# EAGLE design MAX4070_roznicowy_analog (EAGLE 6.3)
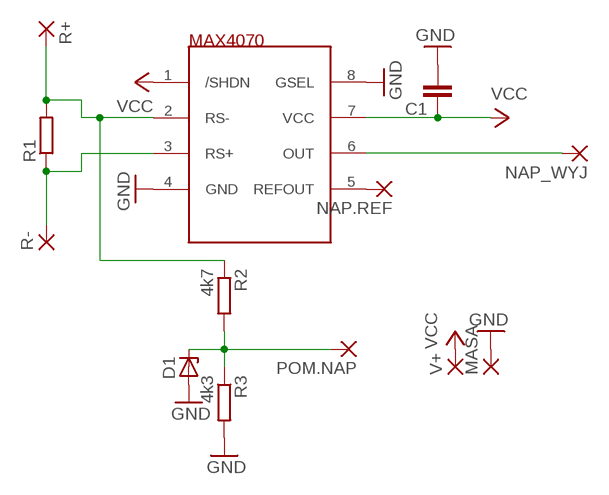
[diagram p0: schematic, sheet 1]

## Parts
C1  C-EUC1206  [C1206]
D1  ZENER-DIODESOD80C  [SOD80C]
MASA  1,6/0,8  [1,6/0,8]
NAP.REF  1,6/0,8  [1,6/0,8]
NAP_WYJ  1,6/0,8  [1,6/0,8]
POM.NAP  1,6/0,8  [1,6/0,8]
R1  R-EU_0617/22  [0617/22]
R2  4k7  R-EU_0207/10  [0207/10]
R3  4k3  R-EU_0207/10  [0207/10]
R+  1,6/0,8  [1,6/0,8]
R-  1,6/0,8  [1,6/0,8]
U$1  MAX4070  [UMAX8]
V+  1,6/0,8  [1,6/0,8]

## Nets
GND: C1.2 D1.A MASA.1(P) R3.2 U$1.4(GND) U$1.8(GSEL)
N$1: NAP_WYJ.1(P) U$1.6(OUT)
N$2: NAP.REF.1(P) U$1.5(REFOUT)
N$3: R1.2 R2.1 R+.1(P) U$1.2(RS-)
N$4: D1.C POM.NAP.1(P) R2.2 R3.1
N$5: R1.1 R-.1(P) U$1.3(RS+)
VCC: C1.1 U$1.1(/SHDN) U$1.7(VCC) V+.1(P)

## Library data of the parts
C1 = rcl:C-EU: CAPACITOR, European symbol
D1 = diode:ZENER-DIODE: Z-Diode
MASA NAP.REF NAP_WYJ POM.NAP R+ R- V+ = wirepad:1,6/0,8: THROUGH-HOLE PAD
R1-R3 = rcl:R-EU_: RESISTOR, European symbol
U$1 = ref-packages:MAX4070

## Net classes
0 default: clearance 0.65 mm

## Board
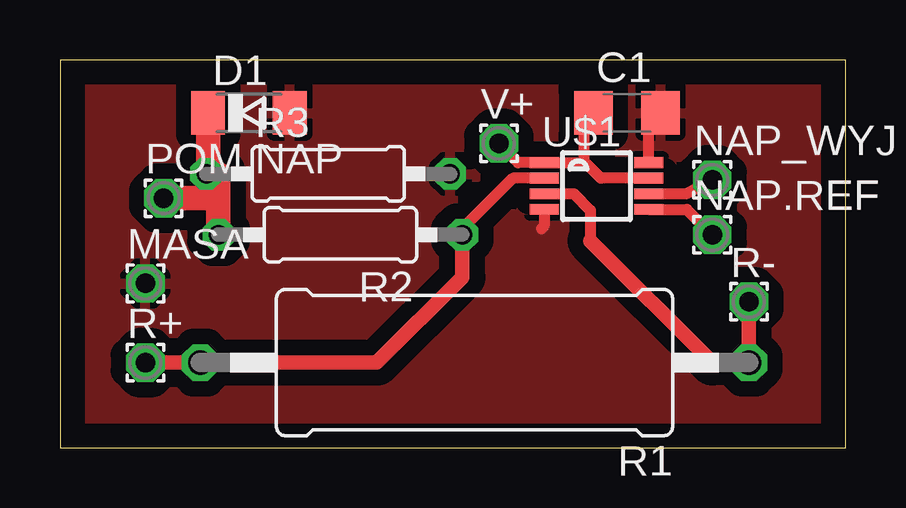
[diagram p1: board, top side]

Size 32.75 x 16.18 mm. Coordinates in mm from the lower left corner, seen from the top.
Outline: 0,0 32.75,0 32.75,16.18 0,16.18 0,0
Copper layers (1*16): Top 0.035mm / dielectric 1.5mm / Bottom 0.035mm
Design rules "default": minimum track width 10mil, minimum drill 24mil, track to track 8mil, track to pad 8mil, pad to pad 8mil, via to via 8mil, smd to smd 8mil, copper to edge 40mil, drill to drill 8mil, minimum pad ring 10mil, minimum via ring 8mil, stop-mask expansion 4mil, vias tented up to drill 0mil, thermal gap 10mil

### Footprints (pad centres in the part's own frame; a part is rotated, then mirrored left to right if it is on the bottom)
C1206 = smd 1.6 x 1.8: 1 -1.4,0; 2 1.4,0
SOD80C = smd 1.4 x 1.8: A 1.7,0; C -1.7,0
1,6/0,8 = drill 0.813 pad 1.6 octagon: 1 0,0
0617/22 = drill 1.016 octagon: 1 -11.43,0; 2 11.43,0
0207/10 = drill 0.813 octagon: 1 -5.08,0; 2 5.08,0
UMAX8 = smd 0.45 x 1.2: 1 -0.975,-2.175; 2 -0.325,-2.175; 3 0.325,-2.175; 4 0.975,-2.175; 5 0.975,2.175; 6 0.325,2.175; 7 -0.325,2.175; 8 -0.975,2.175

### Placement (x,y rotation side)
C1  23.62,13.97 0 top
D1  7.87,13.97 0 top
MASA  3.56,6.86 0 top
NAP.REF  27.18,8.89 0 top
NAP_WYJ  27.18,11.18 0 top
POM.NAP  4.32,10.41 0 top
R1  17.27,3.56 180 top
R2  11.68,8.89 180 top
R3  11.18,11.43 0 top
R+  3.56,3.56 0 top
R-  28.7,6.1 0 top
U$1  22.35,10.92 270 top
V+  18.29,12.7 0 top

### Tracks (layer width: path | path; a pad name or v marks a point on that pad's centre or on a via)
GND
  Top 0.457: U$1.4 20.18,9.25 20.07,9.14 | U$1.8 24.53,13.48 C1.2
  pour Top: -0.25,0 34.04,0 34.04,18.8 -0.25,18.8
N$1
  Top 0.457: U$1.6 26.09,10.6 NAP_WYJ.1
N$2
  Top 0.457: U$1.5 26.12,9.95 NAP.REF.1
N$3
  Top 0.457: R2.1 16.76,9.14 18.87,11.25 U$1.2
  Top 0.61: R+.1 R1.2 13.21,3.56 16.76,7.11 R2.1
N$4
  Top 1.016: D1.C 6.17,11.43 R3.1 6.6,11.43 6.6,10.41 | 6.6,10.41 R2.2 | POM.NAP.1 6.6,10.41
N$5
  Top 0.457: U$1.3 21.41,10.6 22.1,9.91 22.1,8.64
  Top 0.61: 22.1,8.64 27.18,3.56 R1.1 R-.1
VCC
  Top 0.406: 21.8,11.9 21.84,11.94 | 21.84,13.59 C1.1
  Top 0.457: U$1.7 22.54,11.25 21.84,11.94 21.84,13.59 | 21.8,11.9 U$1.1 19.09,11.9 V+.1